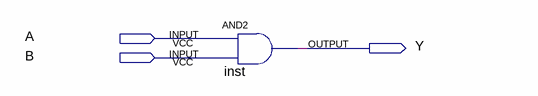
[diagram p0: schematic sheet]
// Quartus schematic projetoandgate.bdf as structural Verilog: 1 symbols, 3 pins
module projetoandgate (
  input  A,
  input  B,
  output Y
);

  and inst (Y, A, B);
endmodule
